# Altium project clusterwink_mk_ii.PrjPcb
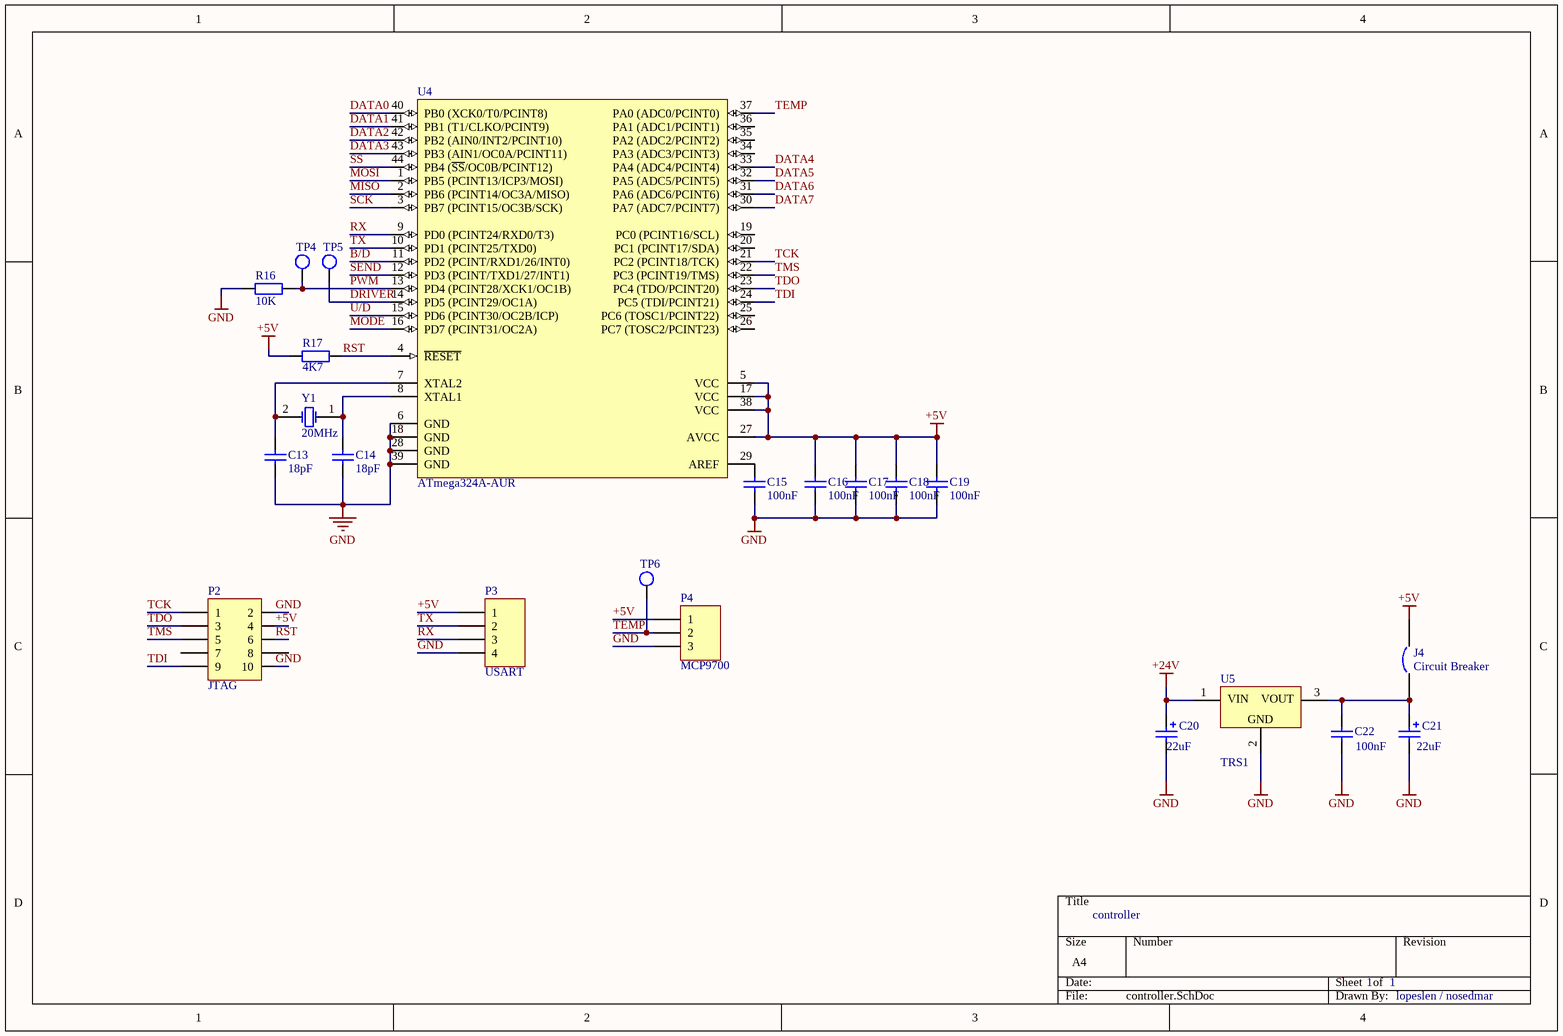
[diagram p0: controller.SchDoc]
5 sheets, 102 parts. Net scope: global (net labels, ports and power ports of the same name join across sheets).
Board file: clusterwink_mk_ii.PcbDoc
Sheets:
  controller.SchDoc
  led.SchDoc
  pi.SchDoc
  powersupply.SchDoc
  audio.SchDoc

## Sheet controller.SchDoc: Sunrise Alarm (Clusterwink)
size A4

### Parts
C13  value 18pF  [6-0805_M]  (hidden comment: Cap)
C14  value 18pF  [6-0805_M]  (hidden comment: Cap)
C15  value 100nF  [6-0805_M]  (hidden comment: Cap)
C16  value 100nF  [6-0805_M]  (hidden comment: Cap)
C17  value 100nF  [6-0805_M]  (hidden comment: Cap)
C18  value 100nF  [6-0805_M]  (hidden comment: Cap)
C19  value 100nF  [6-0805_M]  (hidden comment: Cap)
C20  value 22uF  [EEEFK1H]  (hidden comment: Cap Pol2)
C21  value 22uF  [EEEFK1H]  (hidden comment: Cap Pol2)
C22  value 100nF  [6-0805_M]  (hidden comment: Cap)
J4  Circuit Breaker  [SOLDER_JUMPER_24mil]
P2  JTAG  [HDR2X5]
P3  USART  [HDR1X4]
P4  MCP9700  [HDR1X3]
R16  value 10K  [6-0805_M]  (hidden comment: Res2)
R17  value 4K7  [6-0805_M]  (hidden comment: Res2)
TP4  TestPoint  [MEASUREMENT_POINT]  (value not drawn)
TP5  TestPoint  [MEASUREMENT_POINT]  (value not drawn)
TP6  TestPoint  [MEASUREMENT_POINT]  (value not drawn)
U4  ATmega324A-AUR  [44A_N]
U5  TRS1  [TSR1-2450]
Y1  20MHz  [CRYSTAL]

### Nets
+5V: C16.2 C17.2 C18.2 C19.2 J4.2 P2.4 P3.1 P4.1 R17.2 U4.5(VCC) U4.17(VCC) U4.27(AVCC) U4.38(VCC)
+24V: C20.1 U5.1(+VIN)
GND: C13.1 C14.1 C15.1 C16.1 C17.1 C18.1 C19.1 C20.2 C21.2 C22.1 P2.2 P2.10 P3.4 P4.3 R16.2 U4.6(GND) U4.18(GND) U4.28(GND) U4.39(GND) U5.2(GND)
~{B}/D: U4.11(PD2_(PCINT/RXD1/26/INT0))
DATA0: U4.40(PB0_(XCK0/T0/PCINT8))
DATA1: U4.41(PB1_(T1/CLKO/PCINT9))
DATA2: U4.42(PB2_(AIN0/INT2/PCINT10))
DATA3: U4.43(PB3_(AIN1/OC0A/PCINT11))
DATA4: U4.33(PA4_(ADC4/PCINT4))
DATA5: U4.32(PA5_(ADC5/PCINT5))
DATA6: U4.31(PA6_(ADC6/PCINT6))
DATA7: U4.30(PA7_(ADC7/PCINT7))
DRIVER: TP5.1 U4.14(PD5_(PCINT29/OC1A))
MISO: U4.2(PB6_(PCINT14/OC3A/MISO))
MODE: U4.16(PD7_(PCINT31/OC2A))
MOSI: U4.1(PB5_(PCINT13/ICP3/MOSI))
PWM: R16.1 TP4.1 U4.13(PD4_(PCINT28/XCK1/OC1B))
RST: P2.6 R17.1 U4.4(~{RESET})
RX: P3.3 U4.9(PD0_(PCINT24/RXD0/T3))
~{SS}: U4.44(PB4_(~{SS}/OC0B/PCINT12))
SCK: U4.3(PB7_(PCINT15/OC3B/SCK))
SEND: U4.12(PD3_(PCINT/TXD1/27/INT1))
TCK: P2.1 U4.21(PC2_(PCINT18/TCK))
TDI: P2.9 U4.24(PC5_(TDI/PCINT21))
TDO: P2.3 U4.23(PC4_(TDO/PCINT20))
TEMP: P4.2 TP6.1 U4.37(PA0_(ADC0/PCINT0))
TMS: P2.5 U4.22(PC3_(PCINT19/TMS))
TX: P3.2 U4.10(PD1_(PCINT25/TXD0))
U/D: U4.15(PD6_(PCINT30/OC2B/ICP))
NetC13_2: C13.2 U4.7(XTAL2) Y1.2(OSC2)
NetC14_2: C14.2 U4.8(XTAL1) Y1.1(OSC1)
NetC15_2: C15.2 U4.29(AREF)
NetC21_1: C21.1 C22.2 J4.1 U5.3(+VOUT)

Not connected (* = marked no-connect by the designer): P2 7 8; U4 19(PC0_(PCINT16/SCL)) 20(PC1_(PCINT17/SDA)) 25(PC6_(TOSC1/PCINT22)) 26(PC7_(TOSC2/PCINT23)) 34(PA3_(ADC3/PCINT3)) 35(PA2_(ADC2/PCINT2)) 36(PA1_(ADC1/PCINT1))

### Notes on the sheet
- controller
- 1
- lopeslen / nosedmar
- (in symbol TSR1-2450) VIN; VOUT

### Library data of the parts
C13-C19 C22 = Cap: Capacitor; Published: 8-Jun-2000; LatestRevisionDate: 17-Jul-2002; LatestRevisionNote: Re-released for DXP Platform.; PackageReference: RAD-0.3; Publisher: Altium Limited; PackageDescription: Radial Cap, Thru-Hole; 2 Leads; 0.3 in Pin Spacing
C20 C21 = Cap Pol2: Polarized Capacitor (Axial); Published: 8-Jun-2000; LatestRevisionDate: 17-Jul-2002; LatestRevisionNote: Re-released for DXP Platform.; PackageReference: POLAR0.8; Publisher: Altium Limited; PackageDescription: Polarized Capacitor; 2 Leads
P2 = Header 5X2: Header, 5-Pin, Dual row; LatestRevisionDate: 17-Jul-2002; LatestRevisionNote: Re-released for DXP Platform.; Publisher: Altium Limited
P3 = Header 4: Header, 4-Pin; LatestRevisionDate: 17-Jul-2002; LatestRevisionNote: Re-released for DXP Platform.; Publisher: Altium Limited
P4 = Header 3: Header, 3-Pin; LatestRevisionDate: 17-Jul-2002; LatestRevisionNote: Re-released for DXP Platform.; Publisher: Altium Limited
R16 R17 = Res2: Resistor; Published: 8-Jun-2000; LatestRevisionDate: 17-Jul-2002; LatestRevisionNote: Re-released for DXP Platform.; PackageReference: AXIAL-0.4; Publisher: Altium Limited; PackageDescription: Axial Device, Thru-Hole; 2 Leads; 0.4 in Pin Spacing
U4 = ATmega324A-AUR: 8-bit AVR Microcontroller, 32KB Flash, 1KB EEPROM, 2KB SRAM, 44-pin TQFP, Industrial Grade (-40°C to 85°C), Reel; DatasheetVersion: revC, Jun-2011; PackageVersion: revC, Oct-2010; PackageReference: 44A; PackageDescription: 44-Pin Plastic Thin Profile Quad Flat Pack, 10 x 10 x 1.0 mm Body, 0.8 mm Pitch (TQFP); Code_JEDEC: MS-026-ACB; ComponentLink1Description: Manufacturer URL; ComponentLink1URL: http://www.atmel.com/; ComponentLink2Description: ATmega164A/164PA/324A/324PA/644A/644PA/1284/1284P Datasheet; ComponentLink2URL: http://www.atmel.com/dyn/resources/prod_documents/doc8272.pdf; ComponentLink3Description: ATmega164A/164PA/324A/324PA/644A/644PA/1284/1284P Summary; ComponentLink3URL: http://www.atmel.com/dyn/resources/prod_documents/8272S.pdf
U5 = TSR1-2450: TSR1-2450 DC/DC Step-Down Converter
Y1 = XTAL: Crystal Oscillator; Published: 8-Jun-2000; LatestRevisionDate: 17-Jul-2002; LatestRevisionNote: Re-released for DXP Platform.; PackageReference: R38; Publisher: Altium Limited; PackageDescription: Crystal, Thru-Hole; 2 Leads; Body 3.1 x 8.2 mm (Dia.xH)
J4 = Circuit Breaker: Published: 24-Mar-1999; LatestRevisionDate: 17-Jul-2002; LatestRevisionNote: Re-released for DXP Platform.; PackageReference: SPST-2; Publisher: Altium Limited; PackageDescription: Switch; 2 Leads

## Sheet led.SchDoc
size A
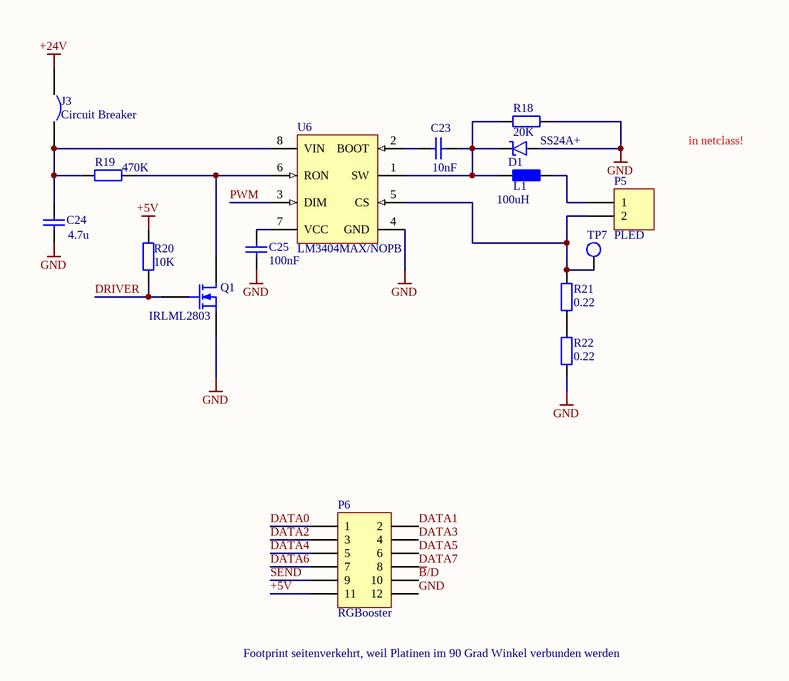
[diagram p1: led.SchDoc]

### Parts
C23  value 10nF  [6-0805_M]  (hidden comment: Cap)
C24  value 4.7u  [C1206]  (hidden comment: Cap)
C25  value 100nF  [6-0805_M]  (hidden comment: Cap)
D1  SS24A+  [DO-214AC]
J3  Circuit Breaker  [SOLDER_JUMPER_24mil]
L1  value 100uH  [ELLCTP]  (hidden comment: Ind)
P5  PLED  [HDR1X2]
P6  RGBooster  [KLEMME_SEITENVERKEHRT]
Q1  IRLML2803  [SOT-23_N]
R18  value 20K  [6-0805_M]  (hidden comment: Res2)
R19  value 470K  [6-0805_M]  (hidden comment: Res2)
R20  value 10K  [6-0805_M]  (hidden comment: Res2)
R21  value 0.22  [C1206]  (hidden comment: Res2)
R22  value 0.22  [C1206]  (hidden comment: Res2)
TP7  TestPoint  [MEASUREMENT_POINT]  (value not drawn)
U6  LM3404MAX/NOPB  [M08A_N]

### Nets
+5V: P6.11 R20.2
+24V: J3.1
GND: C24.1 C25.1 D1.1(A) P6.12 Q1.3(S) R18.1 R22.1 U6.4(GND)
~{B}/D: P6.10
DATA0: P6.1
DATA1: P6.2
DATA2: P6.3
DATA3: P6.4
DATA4: P6.5
DATA5: P6.6
DATA6: P6.7
DATA7: P6.8
DRIVER: Q1.2(G) R20.1
PWM: U6.3(DIM)
SEND: P6.9
NetC23_1: C23.1 U6.2(BOOT)
NetC23_2: C23.2 D1.2(K) L1.1 R18.2 U6.1(SW)
NetC24_2: C24.2 J3.2 R19.1 U6.8(VIN)
NetC25_2: C25.2 U6.7(VCC)
NetL1_2: L1.2 P5.1
NetP5_2: P5.2 R21.2 TP7.1 U6.5(CS)
NetQ1_1: Q1.1(D) R19.2 U6.6(RON)
NetR21_1: R21.1 R22.2

### Notes on the sheet
- in netclass!
- Footprint seitenverkehrt, weil Platinen im 90 Grad Winkel verbunden werden

### Library data of the parts
C23-C25 = Cap: Capacitor; Published: 8-Jun-2000; LatestRevisionDate: 17-Jul-2002; LatestRevisionNote: Re-released for DXP Platform.; PackageReference: RAD-0.3; Publisher: Altium Limited; PackageDescription: Radial Cap, Thru-Hole; 2 Leads; 0.3 in Pin Spacing
D1 = Schottky
L1 = Inductor
P5 = Header 2: Header, 2-Pin; LatestRevisionDate: 17-Jul-2002; LatestRevisionNote: Re-released for DXP Platform.; Publisher: Altium Limited
P6 = Header 6X2: Header, 6-Pin, Dual row; LatestRevisionDate: 17-Jul-2002; LatestRevisionNote: Re-released for DXP Platform.; Publisher: Altium Limited
Q1 = MOSFET-N: N-Channel MOSFET; pin to pad: 1>3 2>1 3>2; Published: 8-Jun-2000; LatestRevisionDate: 17-Jul-2002; LatestRevisionNote: Re-released for DXP Platform.; PackageVersion: 1995/1996; PackageReference: E3; Publisher: Altium Limited; PackageDescription: TO, Flat Index; 3 In-Line, Axial Leads; Body Dia. 4.6mm; Lead Dia. 0.5 mm (max)
R18-R22 = Res2: Resistor; Published: 8-Jun-2000; LatestRevisionDate: 17-Jul-2002; LatestRevisionNote: Re-released for DXP Platform.; PackageReference: AXIAL-0.4; Publisher: Altium Limited; PackageDescription: Axial Device, Thru-Hole; 2 Leads; 0.4 in Pin Spacing
U6 = LM3404MAX/NOPB: 1.0A Constant Current Buck Regulator for High Power LED Drivers, 8-pin Narrow SOIC, Pb-Free; Manufacturer: National Semiconductor; PackageTopMarking: NSZXTT*L3404*MA; PowerWise: Y; CompType: MiscPower; DatasheetVersion: Jun-2007; PackageVersion: revM, May-2009; PackageReference: M08A; PackageDescription: SOIC Narrow, 4.9 x 3.9 x 1.45mm, 8 Lead, 1.27mm Pitch; PartNumber: LM3404MAX/NOPB; RoHS: Y; PinCount: 8; High-Reliability: Y; Code_JEDEC: MS-012-AA; Code_IPC: SOIC127P600-8; ComponentLink1Description: Manufacturer URL; ComponentLink1URL: http://www.national.com/; ComponentLink2Description: LM3404 Datasheet; ComponentLink2URL: http://www.national.com/ds/LM/LM3404.pdf; ComponentLink3Description: LM3404 Web Page; ComponentLink3URL: http://www.national.com/pf/LM/LM3404.html; ComponentLink4Description: M08A Package Page; ComponentLink4URL: http://www.national.com/packaging/folders/m08a.html
J3 = Circuit Breaker: Published: 24-Mar-1999; LatestRevisionDate: 17-Jul-2002; LatestRevisionNote: Re-released for DXP Platform.; PackageReference: SPST-2; Publisher: Altium Limited; PackageDescription: Switch; 2 Leads

## Sheet pi.SchDoc
size A
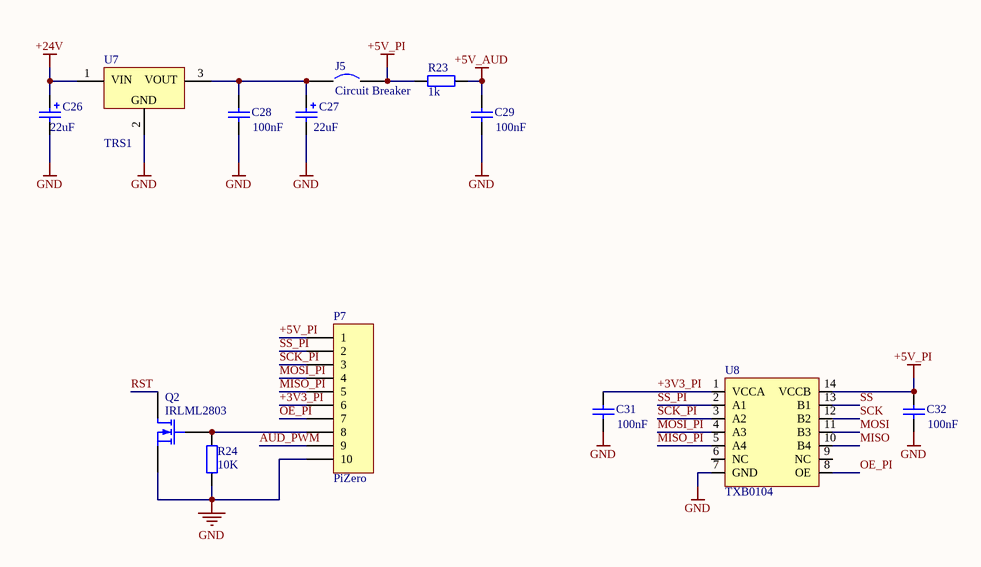
[diagram p2: pi.SchDoc]

### Parts
C26  value 22uF  [EEEFK1H]  (hidden comment: Cap Pol2)
C27  value 22uF  [EEEFK1H]  (hidden comment: Cap Pol2)
C28  value 100nF  [6-0805_M]  (hidden comment: Cap)
C29  value 100nF  [6-0805_M]  (hidden comment: Cap)
C31  value 100nF  [6-0805_M]  (hidden comment: Cap)
C32  value 100nF  [6-0805_M]  (hidden comment: Cap)
J5  Circuit Breaker  [SOLDER_JUMPER_24mil]
P7  PiZero  [HDR1X10]
Q2  IRLML2803  [SOT-23_N]
R23  value 1k  [6-0805_M]  (hidden comment: Res2)
R24  value 10K  [6-0805_M]  (hidden comment: Res2)
U7  TRS1  [TSR1-2450]
U8  TXB0104  [SOIC-14]

### Nets
+5V_AUD: C29.2 R23.2
+5V_PI: C32.2 J5.2 P7.1 R23.1 U8.14(VCCB)
+24V: C26.1 U7.1(+VIN)
GND: C26.2 C27.2 C28.1 C29.1 C31.1 C32.1 P7.10 Q2.3(S) R24.2 U7.2(GND) U8.7(GND)
+3V3_PI: C31.2 P7.6 U8.1(VCCA)
AUD_PWM: P7.9
MISO: U8.10(B4)
MISO_PI: P7.5 U8.5(A4)
MOSI: U8.11(B3)
MOSI_PI: P7.4 U8.4(A3)
OE_PI: P7.7 U8.8(OE)
RST: Q2.1(D)
~{SS}: U8.13(B1)
~{SS}_PI: P7.2 U8.2(A1)
SCK: U8.12(B2)
SCK_PI: P7.3 U8.3(A2)
NetC27_1: C27.1 C28.2 J5.1 U7.3(+VOUT)
NetP7_8: P7.8 Q2.2(G) R24.1

Not connected (* = marked no-connect by the designer): U8 6(NC) 9(NC)

### Notes on the sheet
- (in symbol TSR1-2450) VIN; VOUT

### Library data of the parts
C26 C27 = Cap Pol2: Polarized Capacitor (Axial); Published: 8-Jun-2000; LatestRevisionDate: 17-Jul-2002; LatestRevisionNote: Re-released for DXP Platform.; PackageReference: POLAR0.8; Publisher: Altium Limited; PackageDescription: Polarized Capacitor; 2 Leads
C28 C29 C31 C32 = Cap: Capacitor; Published: 8-Jun-2000; LatestRevisionDate: 17-Jul-2002; LatestRevisionNote: Re-released for DXP Platform.; PackageReference: RAD-0.3; Publisher: Altium Limited; PackageDescription: Radial Cap, Thru-Hole; 2 Leads; 0.3 in Pin Spacing
P7 = Header 10: Header, 10-Pin; LatestRevisionDate: 17-Jul-2002; LatestRevisionNote: Re-released for DXP Platform.; Publisher: Altium Limited
Q2 = MOSFET-N: N-Channel MOSFET; pin to pad: 1>3 2>1 3>2; Published: 8-Jun-2000; LatestRevisionDate: 17-Jul-2002; LatestRevisionNote: Re-released for DXP Platform.; PackageVersion: 1995/1996; PackageReference: E3; Publisher: Altium Limited; PackageDescription: TO, Flat Index; 3 In-Line, Axial Leads; Body Dia. 4.6mm; Lead Dia. 0.5 mm (max)
R23 R24 = Res2: Resistor; Published: 8-Jun-2000; LatestRevisionDate: 17-Jul-2002; LatestRevisionNote: Re-released for DXP Platform.; PackageReference: AXIAL-0.4; Publisher: Altium Limited; PackageDescription: Axial Device, Thru-Hole; 2 Leads; 0.4 in Pin Spacing
U7 = TSR1-2450: TSR1-2450 DC/DC Step-Down Converter
U8 = TXB0104: TXB0104 4bit Bidirectional Voltage-Level Translator
J5 = Circuit Breaker: Published: 24-Mar-1999; LatestRevisionDate: 17-Jul-2002; LatestRevisionNote: Re-released for DXP Platform.; PackageReference: SPST-2; Publisher: Altium Limited; PackageDescription: Switch; 2 Leads

## Sheet powersupply.SchDoc
size A
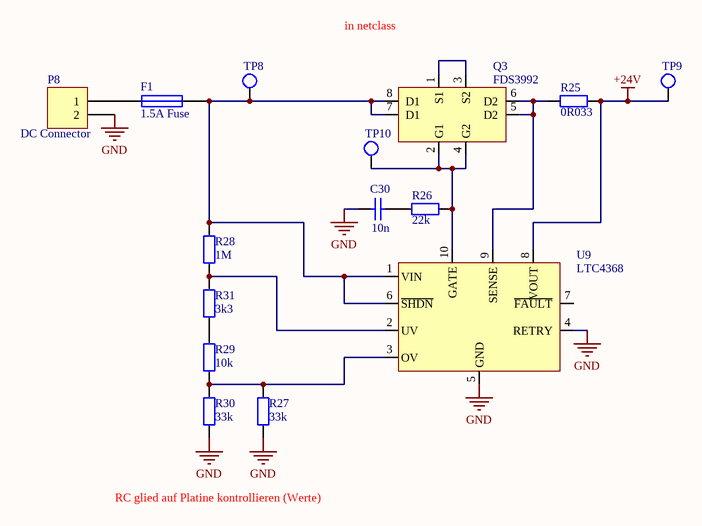
[diagram p3: powersupply.SchDoc]

### Parts
C30  value 10n  [6-0805_M]  (hidden comment: Cap)
F1  1.5A Fuse  [OMNI_BLOK_FUSE]
P8  DC Connector  [HDR1X2]
Q3  FDS3992  [SOIC-8]
R25  value 0R033  [C1206]  (hidden comment: Res2)
R26  value 22k  [6-0805_M]  (hidden comment: Res2)
R27  value 33k  [6-0805_M]  (hidden comment: Res2)
R28  value 1M  [6-0805_M]  (hidden comment: Res2)
R29  value 10k  [6-0805_M]  (hidden comment: Res2)
R30  value 33k  [6-0805_M]  (hidden comment: Res2)
R31  value 3k3  [6-0805_M]  (hidden comment: Res2)
TP8  TestPoint  [MEASUREMENT_POINT]  (value not drawn)
TP9  TestPoint  [MEASUREMENT_POINT]  (value not drawn)
TP10  TestPoint  [MEASUREMENT_POINT]  (value not drawn)
U9  LTC4368  [MSOP-10]

### Nets
+24V: R25.2 TP9.1 U9.8(VOUT)
GND: C30.1 P8.2 R27.1 R30.1 U9.4(RETRY) U9.5(GND)
NetC30_2: C30.2 R26.1
NetF1_1: F1.1 P8.1
NetF1_2: F1.2 Q3.7(D1) Q3.8(D1) R28.2 TP8.1 U9.1(VIN) U9.6(~{SHDN})
NetQ3_1: Q3.1(S1) Q3.3(S2)
NetQ3_2: Q3.2(G1) Q3.4(G2) R26.2 TP10.1 U9.10(GATE)
NetQ3_5: Q3.5(D2) Q3.6(D2) R25.1 U9.9(SENSE)
NetR27_2: R27.2 R29.1 R30.2 U9.3(OV)
NetR28_1: R28.1 R31.2 U9.2(UV)
NetR29_2: R29.2 R31.1

Not connected (* = marked no-connect by the designer): U9 7(~{FAULT})

### Notes on the sheet
- in netclass
- RC glied auf Platine kontrollieren (Werte)

### Library data of the parts
C30 = Cap: Capacitor; Published: 8-Jun-2000; LatestRevisionDate: 17-Jul-2002; LatestRevisionNote: Re-released for DXP Platform.; PackageReference: RAD-0.3; Publisher: Altium Limited; PackageDescription: Radial Cap, Thru-Hole; 2 Leads; 0.3 in Pin Spacing
F1 = Fuse 1: Fuse; Published: 8-Jun-2000; LatestRevisionDate: 17-Jul-2002; LatestRevisionNote: Re-released for DXP Platform.; PackageReference: PIN-W2/E2.8; Publisher: Altium Limited; PackageDescription: Thru-Hole; 2 Leads
P8 = Header 2: Header, 2-Pin; LatestRevisionDate: 17-Jul-2002; LatestRevisionNote: Re-released for DXP Platform.; Publisher: Altium Limited
Q3 = FDS3992: FDS3992 Dual N-Channel MOSFET
R25-R31 = Res2: Resistor; Published: 8-Jun-2000; LatestRevisionDate: 17-Jul-2002; LatestRevisionNote: Re-released for DXP Platform.; PackageReference: AXIAL-0.4; Publisher: Altium Limited; PackageDescription: Axial Device, Thru-Hole; 2 Leads; 0.4 in Pin Spacing
U9 = LTC4368: LTC4368 UV/OV/Reverse Protection IC

## Sheet audio.SchDoc
size A
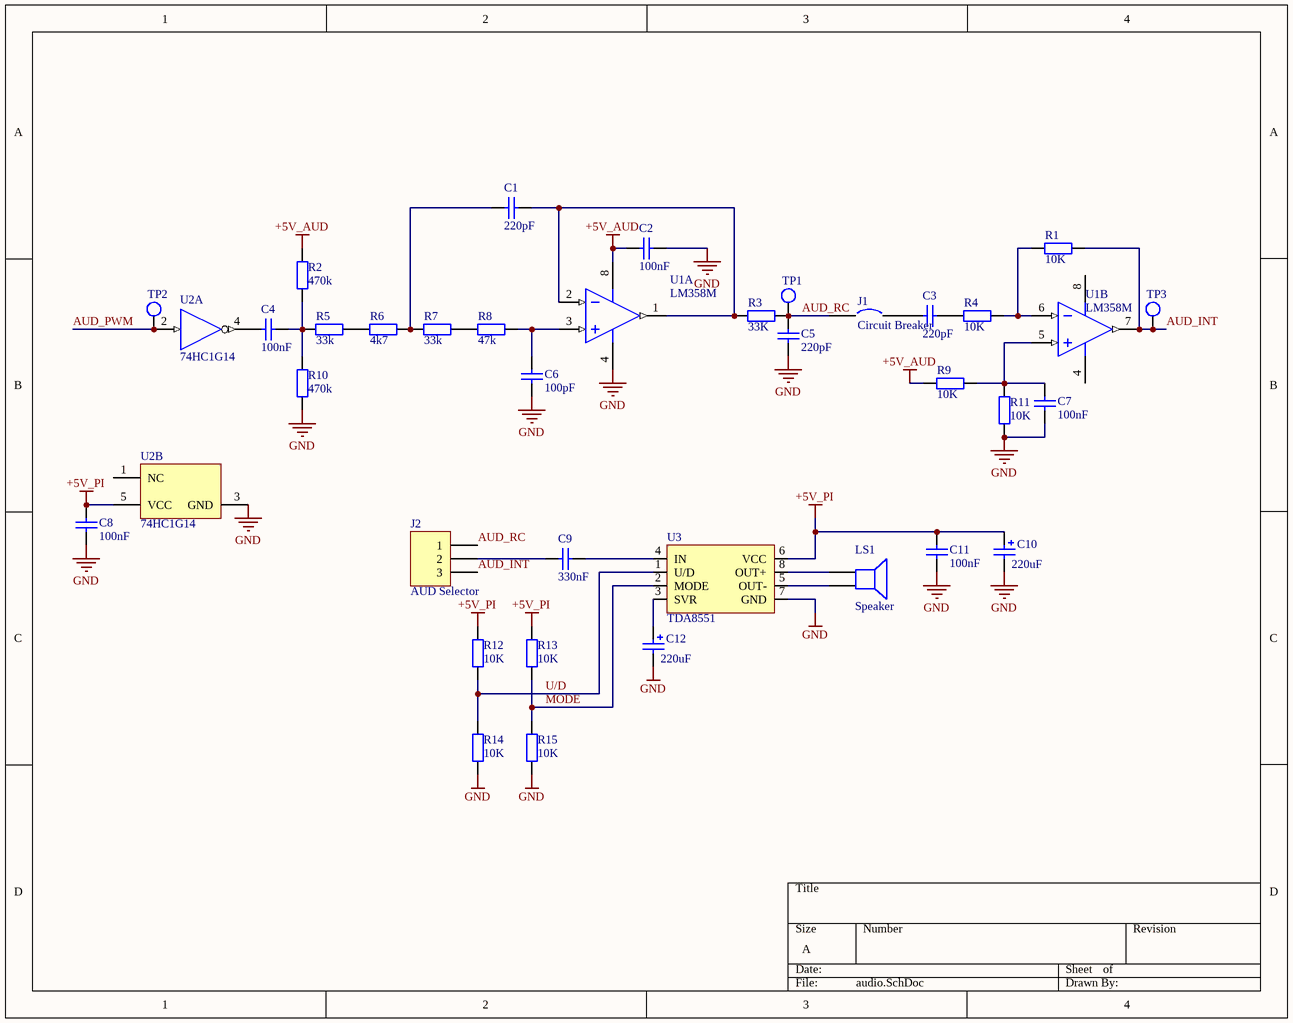
[diagram p4: audio.SchDoc]

### Parts
C1  value 220pF  [6-0805_M]  (hidden comment: Cap)
C2  value 100nF  [6-0805_M]  (hidden comment: Cap)
C3  value 220pF  [6-0805_M]  (hidden comment: Cap)
C4  value 100nF  [6-0805_M]  (hidden comment: Cap)
C5  value 220pF  [6-0805_M]  (hidden comment: Cap)
C6  value 100pF  [6-0805_M]  (hidden comment: Cap)
C7  value 100nF  [6-0805_M]  (hidden comment: Cap)
C8  value 100nF  [6-0805_M]  (hidden comment: Cap)
C9  value 330nF  [6-0805_M]  (hidden comment: Cap)
C10  value 220uF  [EEEFK1H]  (hidden comment: Cap Pol2)
C11  value 100nF  [6-0805_M]  (hidden comment: Cap)
C12  value 220uF  [EEEFK1H]  (hidden comment: Cap Pol2)
J1  Circuit Breaker  [SOLDER_JUMPER_24mil]
J2  AUD Selector  [SOLDER_SELECTOR_24mil]
LS1  Speaker  [HDR1X2]
R1  value 10K  [6-0805_M]  (hidden comment: Res2)
R2  value 470k  [6-0805_M]  (hidden comment: Res2)
R3  value 33K  [6-0805_M]  (hidden comment: Res2)
R4  value 10K  [6-0805_M]  (hidden comment: Res2)
R5  value 33k  [6-0805_M]  (hidden comment: Res2)
R6  value 4k7  [6-0805_M]  (hidden comment: Res2)
R7  value 33k  [6-0805_M]  (hidden comment: Res2)
R8  value 47k  [6-0805_M]  (hidden comment: Res2)
R9  value 10K  [6-0805_M]  (hidden comment: Res2)
R10  value 470k  [6-0805_M]  (hidden comment: Res2)
R11  value 10K  [6-0805_M]  (hidden comment: Res2)
R12  value 10K  [6-0805_M]  (hidden comment: Res2)
R13  value 10K  [6-0805_M]  (hidden comment: Res2)
R14  value 10K  [6-0805_M]  (hidden comment: Res2)
R15  value 10K  [6-0805_M]  (hidden comment: Res2)
TP1  TestPoint  [MEASUREMENT_POINT]  (value not drawn)
TP2  TestPoint  [MEASUREMENT_POINT]  (value not drawn)
TP3  TestPoint  [MEASUREMENT_POINT]  (value not drawn)
U1  LM358M  [M08A_N]  (parts A,B of 2)
U2  74HC1G14  [DBV0005A_N]  (parts A,B of 2)
U3  TDA8551  [SOIC-8]

### Nets
+5V_AUD: C2.2 R2.2 R9.1 U1.8(V+)
+5V_PI: C8.1 C10.1 C11.1 R12.2 R13.2 U2.5(VCC) U3.6(VCC)
GND: C2.1 C5.1 C6.2 C7.2 C8.2 C10.2 C11.2 C12.2 R10.1 R11.1 R14.1 R15.1 U1.4(GND) U2.3(GND) U3.7(GND)
AUD_INT: J2.3 R1.2 TP3.1 U1.7(OUTB)
AUD_PWM: TP2.1 U2.2(A)
AUD_RC: C5.2 J1.1 J2.1 R3.2 TP1.1
MODE: R13.1 R15.2 U3.2(MODE)
U/D: R12.1 R14.2 U3.1(U/D)
NetC1_1: C1.1 R3.1 U1.1(OUTA) U1.2(INA-)
NetC1_2: C1.2 R6.2 R7.1
NetC3_1: C3.1 R4.1
NetC3_2: C3.2 J1.2
NetC4_1: C4.1 R2.1 R5.1 R10.2
NetC4_2: C4.2 U2.4(Y)
NetC6_1: C6.1 R8.2 U1.3(INA+)
NetC7_1: C7.1 R9.2 R11.2 U1.5(INB+)
NetC9_1: C9.1 U3.4(IN)
NetC9_2: C9.2 J2.2
NetC12_1: C12.1 U3.3(SVR)
NetLS1_1: LS1.1 U3.8(OUT+)
NetLS1_2: LS1.2 U3.5(OUT-)
NetR1_1: R1.1 R4.2 U1.6(INB-)
NetR5_2: R5.2 R6.1
NetR7_2: R7.2 R8.1

Not connected (* = marked no-connect by the designer): U2 1(NC)

### Library data of the parts
C1-C9 C11 = Cap: Capacitor; Published: 8-Jun-2000; LatestRevisionDate: 17-Jul-2002; LatestRevisionNote: Re-released for DXP Platform.; PackageReference: RAD-0.3; Publisher: Altium Limited; PackageDescription: Radial Cap, Thru-Hole; 2 Leads; 0.3 in Pin Spacing
C10 C12 = Cap Pol2: Polarized Capacitor (Axial); Published: 8-Jun-2000; LatestRevisionDate: 17-Jul-2002; LatestRevisionNote: Re-released for DXP Platform.; PackageReference: POLAR0.8; Publisher: Altium Limited; PackageDescription: Polarized Capacitor; 2 Leads
J2 = Header 3: Header, 3-Pin; LatestRevisionDate: 17-Jul-2002; LatestRevisionNote: Re-released for DXP Platform.; Publisher: Altium Limited
LS1 = Speaker: Loudspeaker; Published: 24-Mar-1999; LatestRevisionDate: 17-Jul-2002; LatestRevisionNote: Re-released for DXP Platform.; PackageReference: PIN2; Publisher: Altium Limited
R1-R15 = Res2: Resistor; Published: 8-Jun-2000; LatestRevisionDate: 17-Jul-2002; LatestRevisionNote: Re-released for DXP Platform.; PackageReference: AXIAL-0.4; Publisher: Altium Limited; PackageDescription: Axial Device, Thru-Hole; 2 Leads; 0.4 in Pin Spacing
U1 = LM358M: Low Power Dual Operational Amplifier, 8-pin Narrow SOIC; Manufacturer: National Semiconductor; PackageTopMarking: NSZXTT*LM*358M; PowerWise: N; CompType: Amplifiers; High-Reliability: Y; DatasheetVersion: Oct-2005; PackageVersion: revM, May-2009; PackageReference: M08A; PackageDescription: SOIC Narrow, 4.9 x 3.9 x 1.45mm, 8 Lead, 1.27mm Pitch; PartNumber: LM358M; RoHS: N; PinCount: 8; Code_JEDEC: MS-012-AA; Code_IPC: SOIC127P600-8; ComponentLink1Description: Manufacturer URL; ComponentLink1URL: http://www.national.com/; ComponentLink2Description: LM358 Datasheet; ComponentLink2URL: http://www.national.com/ds/LM/LM358.pdf; ComponentLink3Description: LM358 Web Page; ComponentLink3URL: http://www.national.com/pf/LM/LM358.html; ComponentLink4Description: M08A Package Page; ComponentLink4URL: http://www.national.com/packaging/folders/m08a.html
U2 = SN74AHC1G14DBVT: Single Schmitt-Trigger Inverter Gate, DBV0005A, SMALL T&R; Manufacturer: Texas Instruments; VCC(Min)(V): 2; VCC(Max)(V): 5.5; Output Type: CMOS; ICC @ Nom Voltage(Max)(mA): 0.01; Bits(#): 1; F @ Nom Voltage(Max)(Mhz): 75; Rating: Catalog; Technology Family: AHC; Voltage(Nom)(V): 3.3,5; Schmitt Trigger: Yes; Output Drive (IOL/IOH)(Max)(mA): 50/-50; tpd @ Nom Voltage(Max)(ns): 16.3,10.6; Logic: Inverting; Sub-Family: Inverting Buffer/Driver; 3-State Output: No; DatasheetVersion: SCLS321P; PackageReference: DBV0005A; Supplier 1: Mouser; Supplier Part Number 1: 595-SN74AHC1G14DBVT; Supplier 2: Digi-Key; Supplier Part Number 2: 296-26401-2-ND; Supplier 3: Digi-Key; Supplier Part Number 3: 296-26401-1-ND; Supplier 4: Digi-Key; Supplier Part Number 4: 296-26401-6-ND; Generic Part Number: SN74AHC1G14; Input Type: CMOS; Operating Temperature Range(C): -40 to 125; PartNumber: SN74AHC1G14DBVT; ComponentLink1Description: Manufacturer URL; ComponentLink1URL: http://www.ti.com/; ComponentLink2Description: Datasheet; ComponentLink2URL: http://www.ti.com/lit/ds/symlink/sn74ahc1g14.pdf
U3 = TDA8551: TDA8551 1W Audio Amplifier
J1 = Circuit Breaker: Published: 24-Mar-1999; LatestRevisionDate: 17-Jul-2002; LatestRevisionNote: Re-released for DXP Platform.; PackageReference: SPST-2; Publisher: Altium Limited; PackageDescription: Switch; 2 Leads

## Nets that join several sheets
+5V: controller (13 pins), led (P6.11 R20.2)
+5V_AUD: pi (C29.2 R23.2), audio (C2.2 R2.2 R9.1 U1.8)
+5V_PI: pi (5 pins), audio (7 pins)
+24V: controller (C20.1 U5.1), led (J3.1), pi (C26.1 U7.1), powersupply (R25.2 TP9.1 U9.8)
GND: controller (20 pins), led (8 pins), pi (11 pins), powersupply (6 pins), audio (15 pins)
AUD_PWM: pi (P7.9), audio (TP2.1 U2.2)
~{B}/D: controller (U4.11), led (P6.10)
DATA0: controller (U4.40), led (P6.1)
DATA1: controller (U4.41), led (P6.2)
DATA2: controller (U4.42), led (P6.3)
DATA3: controller (U4.43), led (P6.4)
DATA4: controller (U4.33), led (P6.5)
DATA5: controller (U4.32), led (P6.6)
DATA6: controller (U4.31), led (P6.7)
DATA7: controller (U4.30), led (P6.8)
DRIVER: controller (TP5.1 U4.14), led (Q1.2 R20.1)
MISO: controller (U4.2), pi (U8.10)
MODE: controller (U4.16), audio (R13.1 R15.2 U3.2)
MOSI: controller (U4.1), pi (U8.11)
PWM: controller (R16.1 TP4.1 U4.13), led (U6.3)
RST: controller (P2.6 R17.1 U4.4), pi (Q2.1)
~{SS}: controller (U4.44), pi (U8.13)
SCK: controller (U4.3), pi (U8.12)
SEND: controller (U4.12), led (P6.9)
U/D: controller (U4.15), audio (R12.1 R14.2 U3.1)